# Altium schematic sheet fMUX_MB.SchDoc: FPGA Motherboard for Digital Multiplexed Readout, McGill U.
size Tabloid; DocumentNumber: DfMUX1; Revision: Rev0, Prototype; SheetNumber: 1; SheetTotal: 27; PageSetup: Record=PageOptions|CenterHorizontal=True|CenterVertical=True|PrintScale=0.72|XCorrection=1.00|YCorrection=1.00|PrintKind=0|BorderSize=5000000|LeftOffset=0|BottomOffset=0|Orientation=2|PaperLength=1000|PaperWidth=1000|Scale=100|PaperSource=7|PrintQuality=-4|MediaType=1|DitherType=10|PaperKind=Letter|PrintScaleMode=1
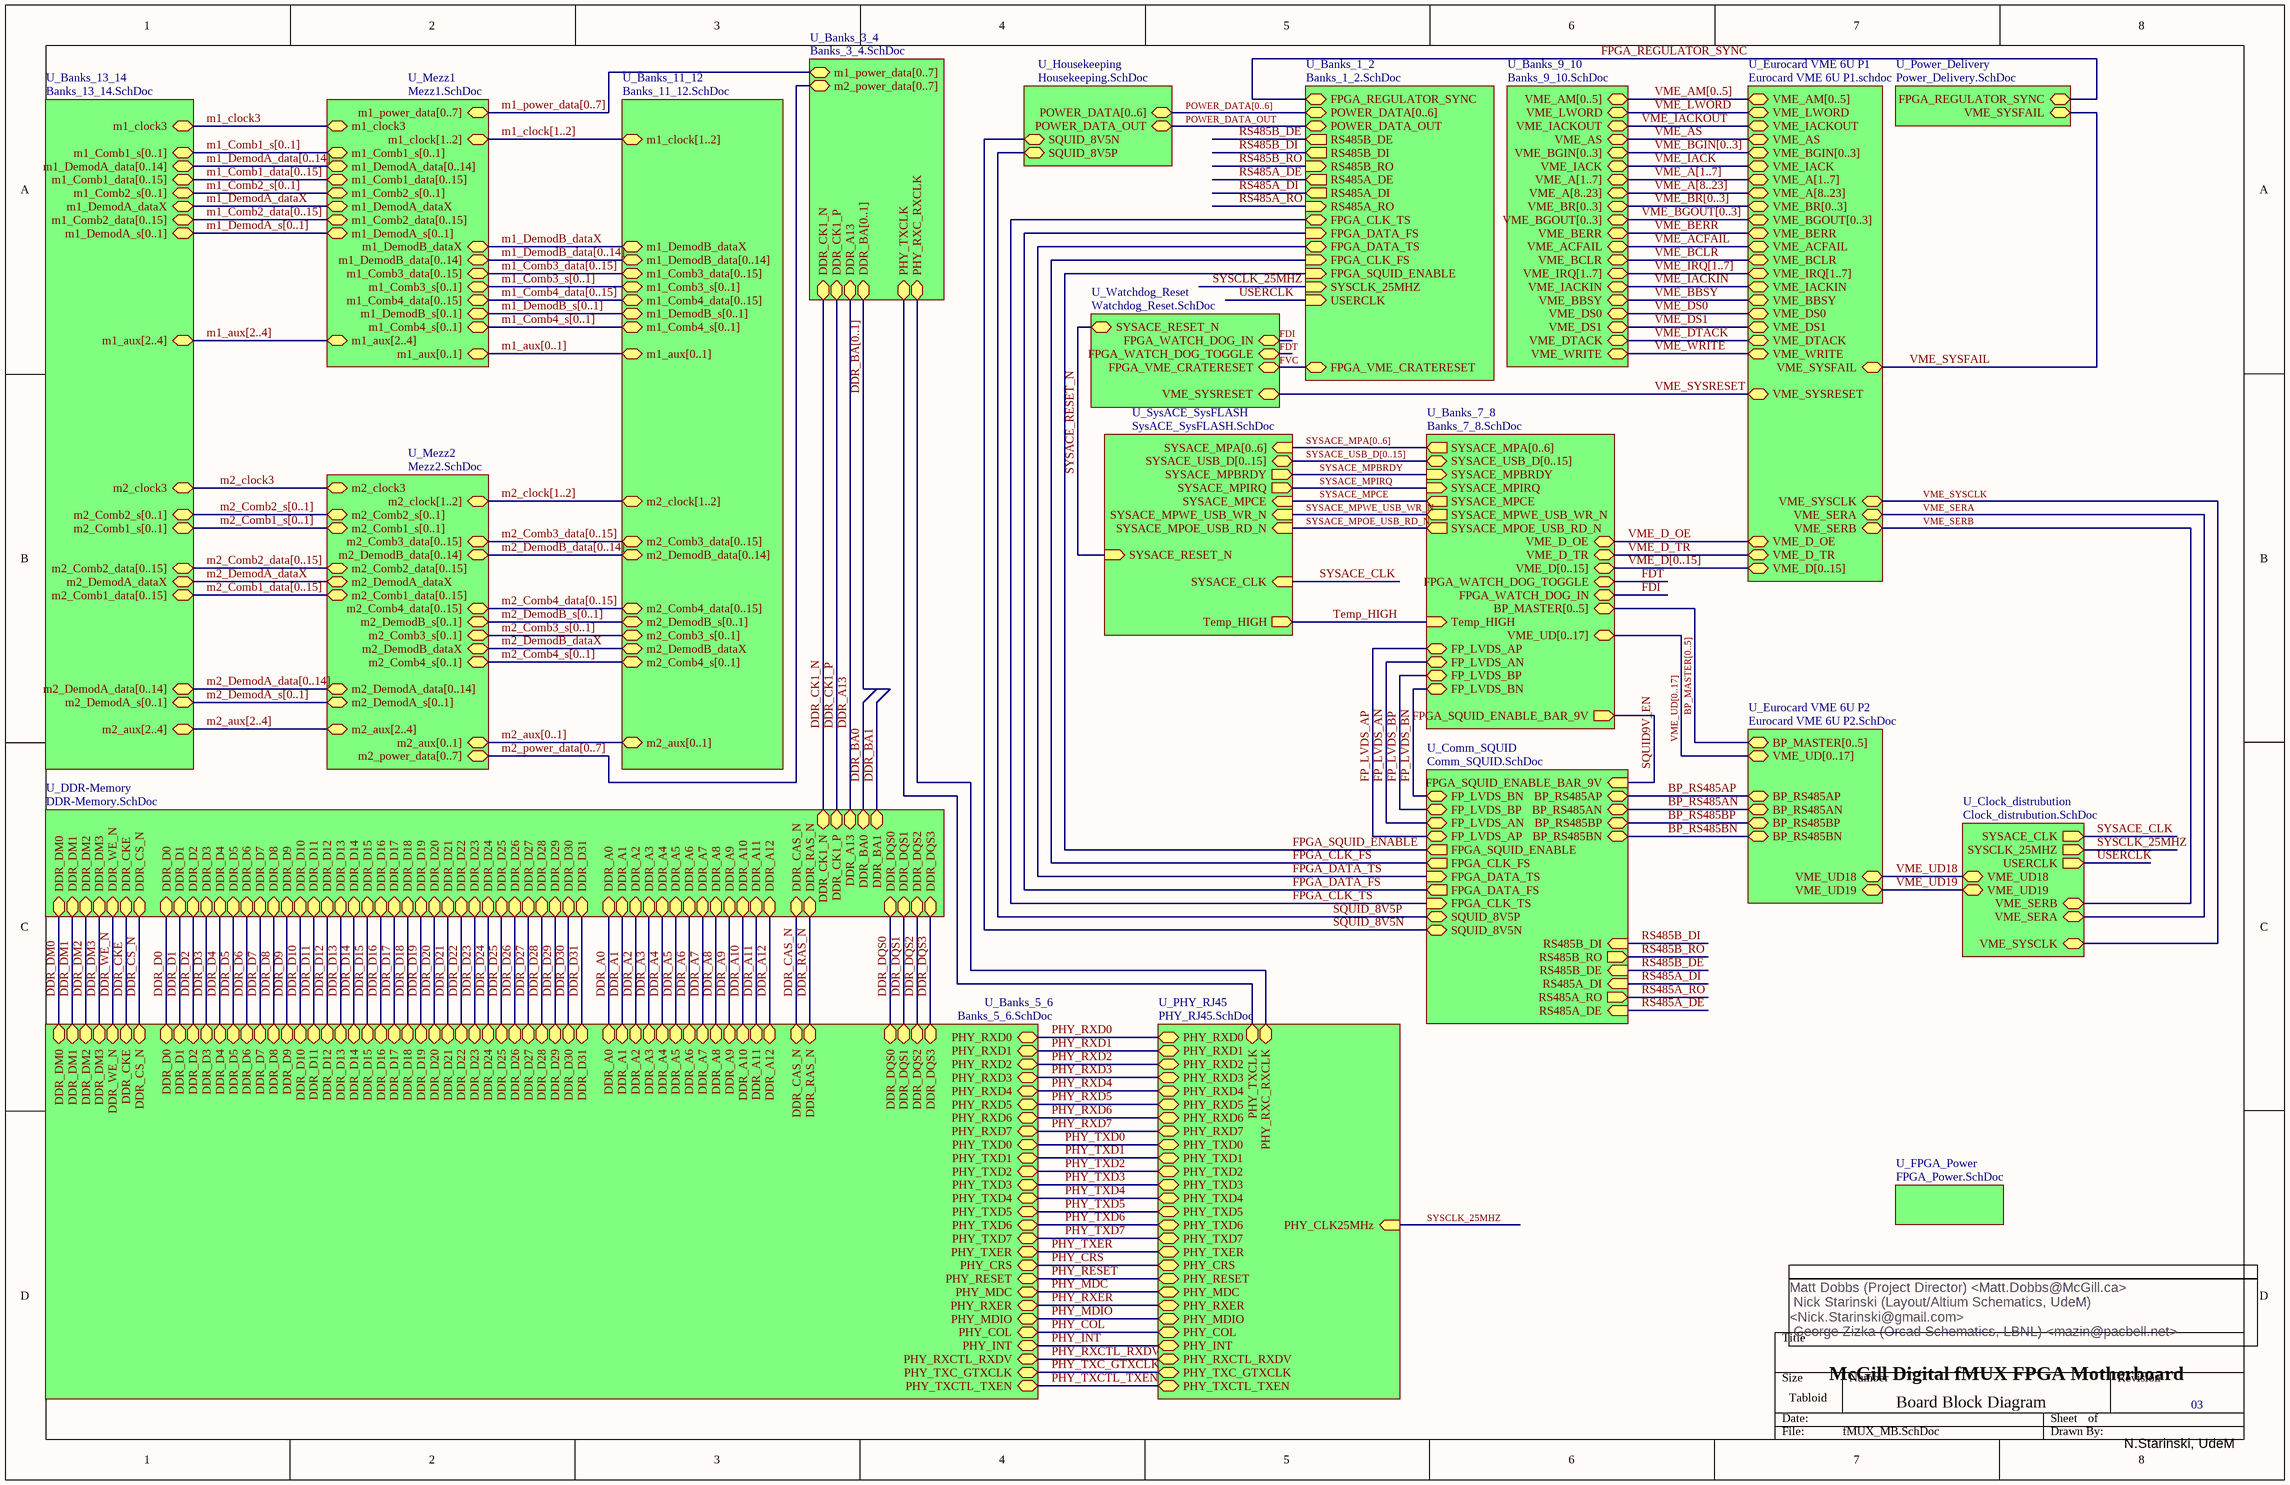
[diagram p0: fMUX_MB.SchDoc]

## Sub-sheets
U_Banks_1_2 = Banks_1_2.SchDoc: POWER_DATA[0..6], POWER_DATA_OUT (bidir), RS485B_RO (in), RS485B_DE (out), FPGA_SQUID_ENABLE (in), SYSCLK_25MHZ (in), USERCLK (in), FPGA_VME_CRATERESET (bidir), RS485A_DE (out), FPGA_REGULATOR_SYNC (bidir), FPGA_DATA_FS (in), FPGA_CLK_TS (bidir), FPGA_DATA_TS (bidir), RS485A_DI (out), FPGA_CLK_FS (in), RS485B_DI (out), RS485A_RO (in)
U_Banks_3_4 = Banks_3_4.SchDoc: m1_power_data[0..7], m2_power_data[0..7] (bidir), DDR_A13 (bidir), DDR_CK1_P (bidir), PHY_TXCLK (bidir), DDR_CK1_N (bidir), PHY_RXC_RXCLK (bidir), DDR_BA[0..1] (bidir)
U_Banks_5_6 = Banks_5_6.SchDoc: DDR_D0 (bidir), DDR_D2 (bidir), DDR_D6 (bidir), DDR_D3 (bidir), DDR_D8 (bidir), DDR_D1 (bidir), DDR_D9 (bidir), DDR_D7 (bidir), DDR_D11 (bidir), DDR_D12 (bidir), DDR_D13 (bidir), DDR_D29 (bidir), DDR_A1 (bidir), DDR_D4 (bidir), DDR_D5 (bidir), DDR_D16 (bidir), DDR_DQS3 (bidir), DDR_DM2 (bidir), DDR_DQS2 (bidir), DDR_D15 (bidir), DDR_D18 (bidir), DDR_D19 (bidir), DDR_D20 (bidir), DDR_A7 (bidir), DDR_A8 (bidir), DDR_A11 (bidir), DDR_D10 (bidir), DDR_D17 (bidir), DDR_A12 (bidir), DDR_DM0 (bidir), DDR_DQS1 (bidir), DDR_A2 (bidir), DDR_CAS_N (bidir), DDR_A9 (bidir), DDR_DM3 (bidir), DDR_DQS0 (bidir), DDR_RAS_N (bidir), DDR_DM1 (bidir), DDR_D14 (bidir), DDR_A4 (bidir), DDR_A5 (bidir), DDR_A10 (bidir), DDR_WE_N (bidir), DDR_D21 (bidir), DDR_D22 (bidir), DDR_D23 (bidir), DDR_D24 (bidir), DDR_A6 (bidir), DDR_A3 (bidir), DDR_D26 (bidir), DDR_D31 (bidir), DDR_A0 (bidir), DDR_D27 (bidir), DDR_D28 (bidir), DDR_D30 (bidir), DDR_D25 (bidir), PHY_TXD6 (bidir), PHY_RXD0 (bidir), PHY_RXD2 (bidir), PHY_RXD7 (bidir), PHY_MDIO (bidir), PHY_TXCTL_TXEN (bidir), PHY_RXD4 (bidir), PHY_RXD5 (bidir), PHY_RXD6 (bidir), PHY_TXER (bidir), PHY_MDC (bidir), PHY_COL (bidir), PHY_RXD3 (bidir), PHY_RXER (bidir), PHY_TXD1 (bidir), PHY_TXD3 (bidir), PHY_RXD1 (bidir), PHY_RXCTL_RXDV (bidir), PHY_CRS (bidir), PHY_TXC_GTXCLK (bidir), PHY_RESET (bidir), PHY_TXD0 (bidir), PHY_TXD5 (bidir), PHY_TXD2 (bidir), PHY_TXD4 (bidir), PHY_TXD7 (bidir), PHY_INT (bidir), DDR_CS_N (bidir), DDR_CKE (bidir)
U_Banks_7_8 = Banks_7_8.SchDoc: BP_MASTER[0..5], FP_LVDS_BP (bidir), VME_D[0..15] (bidir), FP_LVDS_BN (bidir), FP_LVDS_AP (bidir), FP_LVDS_AN (bidir), VME_UD[0..17] (bidir), SYSACE_MPA[0..6] (out), SYSACE_USB_D[0..15], VME_D_OE (bidir), SYSACE_MPIRQ (in), SYSACE_MPCE (out), VME_D_TR (bidir), SYSACE_MPBRDY (in), SYSACE_MPOE_USB_RD_N (out), SYSACE_MPWE_USB_WR_N (out), Temp_HIGH (in), FPGA_WATCH_DOG_TOGGLE (bidir), FPGA_WATCH_DOG_IN (bidir), FPGA_SQUID_ENABLE_BAR_9V (out)
U_Banks_9_10 = Banks_9_10.SchDoc: VME_AM[0..5] (bidir), VME_LWORD (bidir), VME_IACKOUT (bidir), VME_AS (bidir), VME_BGIN[0..3] (bidir), VME_IACK (bidir), VME_A[8..23] (bidir), VME_BR[0..3] (bidir), VME_BGOUT[0..3] (bidir), VME_BERR (bidir), VME_A[1..7] (bidir), VME_ACFAIL (bidir), VME_BCLR (bidir), VME_IRQ[1..7] (bidir), VME_IACKIN (bidir), VME_BBSY (bidir), VME_DS0 (bidir), VME_DS1 (bidir), VME_DTACK (bidir), VME_WRITE (bidir)
U_Banks_11_12 = Banks_11_12.SchDoc: m1_Comb3_s[0..1] (bidir), m2_Comb3_s[0..1] (bidir), m1_Comb4_s[0..1] (bidir), m2_Comb4_s[0..1] (bidir), m2_DemodB_data[0..14] (bidir), m1_DemodB_data[0..14] (bidir), m1_Comb4_data[0..15] (bidir), m1_Comb3_data[0..15] (bidir), m2_Comb3_data[0..15] (bidir), m2_Comb4_data[0..15] (bidir), m2_aux[0..1] (bidir), m1_DemodB_s[0..1] (bidir), m2_DemodB_s[0..1] (bidir), m1_clock[1..2] (bidir), m1_DemodB_dataX (bidir), m2_DemodB_dataX (bidir), m2_clock[1..2] (bidir), m1_aux[0..1] (bidir)
U_Banks_13_14 = Banks_13_14.SchDoc: m2_DemodA_s[0..1] (bidir), m1_clock3 (bidir), m1_DemodA_data[0..14] (bidir), m2_Comb1_data[0..15] (bidir), m1_DemodA_s[0..1] (bidir), m1_Comb2_data[0..15] (bidir), m2_Comb1_s[0..1] (bidir), m1_aux[2..4] (bidir), m2_Comb2_data[0..15] (bidir), m2_Comb2_s[0..1] (bidir), m2_aux[2..4] (bidir), m1_Comb1_data[0..15] (bidir), m1_Comb2_s[0..1] (bidir), m1_Comb1_s[0..1] (bidir), m1_DemodA_dataX (bidir), m2_DemodA_dataX (bidir), m2_DemodA_data[0..14] (bidir), m2_clock3 (bidir)
U_Clock_distrubution = Clock_distrubution.SchDoc: SYSACE_CLK (out), SYSCLK_25MHZ (out), USERCLK (out), VME_UD18 (bidir), VME_UD19 (bidir), VME_SYSCLK (bidir), VME_SERA (bidir), VME_SERB (bidir)
U_Comm_SQUID = Comm_SQUID.SchDoc: BP_RS485BP (bidir), BP_RS485BN (bidir), BP_RS485AP (bidir), BP_RS485AN (bidir), FP_LVDS_BN (bidir), FP_LVDS_BP (bidir), FP_LVDS_AN (bidir), FP_LVDS_AP (bidir), FPGA_CLK_TS (in), FPGA_DATA_FS (out), FPGA_CLK_FS (out), SQUID_8V5N, FPGA_DATA_TS (in), RS485B_DE (in), RS485B_RO (out), RS485A_DE (in), RS485A_RO (out), SQUID_8V5P, RS485A_DI (in), FPGA_SQUID_ENABLE (out), RS485B_DI (in), FPGA_SQUID_ENABLE_BAR_9V (in)
U_DDR-Memory = DDR-Memory.SchDoc: DDR_A11 (bidir), DDR_D27 (bidir), DDR_D7 (bidir), DDR_A8 (bidir), DDR_D25 (bidir), DDR_A7 (bidir), DDR_A6 (bidir), DDR_DM0 (bidir), DDR_DM1 (bidir), DDR_D20 (bidir), DDR_DQS2 (bidir), DDR_DQS3 (bidir), DDR_D16 (bidir), DDR_D8 (bidir), DDR_D13 (bidir), DDR_D0 (bidir), DDR_A4 (bidir), DDR_D19 (bidir), DDR_A2 (bidir), DDR_A12 (bidir), DDR_D28 (bidir), DDR_D30 (bidir), DDR_A13 (bidir), DDR_A5 (bidir), DDR_D10 (bidir), DDR_A10 (bidir), DDR_D12 (bidir), DDR_D31 (bidir), DDR_DM3 (bidir), DDR_D14 (bidir), DDR_D29 (bidir), DDR_D21 (bidir), DDR_D24 (bidir), DDR_D6 (bidir), DDR_D11 (bidir), DDR_D5 (bidir), DDR_D15 (bidir), DDR_D4 (bidir), DDR_D18 (bidir), DDR_D2 (bidir), DDR_D9 (bidir), DDR_A3 (bidir), DDR_A0 (bidir), DDR_CK1_N (bidir), DDR_D3 (bidir), DDR_D23 (bidir), DDR_D26 (bidir), DDR_D17 (bidir), DDR_A1 (bidir), DDR_DM2 (bidir), DDR_A9 (bidir), DDR_D1 (bidir), DDR_BA0 (bidir), DDR_DQS1 (bidir), DDR_CAS_N (bidir), DDR_CS_N (bidir), DDR_CKE (bidir), DDR_WE_N (bidir), DDR_BA1 (bidir), DDR_D22 (bidir), DDR_DQS0 (bidir), DDR_CK1_P (bidir), DDR_RAS_N (bidir)
U_Eurocard VME 6U P1 = Eurocard VME 6U P1.schdoc: VME_DTACK (bidir), VME_BGIN[0..3] (bidir), VME_BCLR (bidir), VME_IACKIN (bidir), VME_BGOUT[0..3] (bidir), VME_IRQ[1..7] (bidir), VME_BBSY (bidir), VME_BR[0..3] (bidir), VME_DS1 (bidir), VME_ACFAIL (bidir), VME_A[1..7] (bidir), VME_IACK (bidir), VME_AM[0..5] (bidir), VME_D[0..15] (bidir), VME_BERR (bidir), VME_LWORD (bidir), VME_IACKOUT (bidir), VME_A[8..23] (bidir), VME_WRITE (bidir), VME_AS (bidir), VME_DS0 (bidir), VME_SYSFAIL (bidir), VME_D_OE (bidir), VME_SYSRESET (bidir), VME_D_TR (bidir), VME_SYSCLK (bidir), VME_SERA (bidir), VME_SERB (bidir)
U_Eurocard VME 6U P2 = Eurocard VME 6U P2.SchDoc: BP_RS485BN (bidir), BP_MASTER[0..5], BP_RS485BP (bidir), BP_RS485AN (bidir), BP_RS485AP (bidir), VME_UD[0..17] (bidir), VME_UD18 (bidir), VME_UD19 (bidir)
U_FPGA_Power = FPGA_Power.SchDoc: no entries
U_Housekeeping = Housekeeping.SchDoc: POWER_DATA[0..6], POWER_DATA_OUT (bidir), SQUID_8V5N, SQUID_8V5P
U_Mezz1 = Mezz1.SchDoc: m1_power_data[0..7], m1_Comb1_s[0..1] (bidir), m1_DemodA_data[0..14] (bidir), m1_Comb1_data[0..15] (bidir), m1_DemodB_data[0..14] (bidir), m1_DemodB_dataX (bidir), m1_Comb4_s[0..1] (bidir), m1_Comb2_data[0..15] (bidir), m1_DemodB_s[0..1] (bidir), m1_DemodA_s[0..1] (bidir), m1_DemodA_dataX (bidir), m1_Comb3_data[0..15] (bidir), m1_Comb2_s[0..1] (bidir), m1_Comb3_s[0..1] (bidir), m1_Comb4_data[0..15] (bidir), m1_aux[2..4] (bidir), m1_clock[1..2] (bidir), m1_clock3 (bidir), m1_aux[0..1] (bidir)
U_Mezz2 = Mezz2.SchDoc: m2_power_data[0..7] (bidir), m2_Comb3_s[0..1] (bidir), m2_Comb2_data[0..15] (bidir), m2_DemodA_s[0..1] (bidir), m2_Comb4_s[0..1] (bidir), m2_Comb4_data[0..15] (bidir), m2_DemodB_s[0..1] (bidir), m2_DemodA_data[0..14] (bidir), m2_Comb2_s[0..1] (bidir), m2_Comb3_data[0..15] (bidir), m2_DemodB_data[0..14] (bidir), m2_Comb1_data[0..15] (bidir), m2_Comb1_s[0..1] (bidir), m2_DemodA_dataX (bidir), m2_DemodB_dataX (bidir), m2_clock[1..2] (bidir), m2_aux[2..4] (bidir), m2_clock3 (bidir), m2_aux[0..1] (bidir)
U_PHY_RJ45 = PHY_RJ45.SchDoc: PHY_RXD3 (bidir), PHY_RXD4 (bidir), PHY_RXD0 (bidir), PHY_RXD5 (bidir), PHY_RXD1 (bidir), PHY_RXD7 (bidir), PHY_RXD6 (bidir), PHY_RXD2 (bidir), PHY_RXC_RXCLK (bidir), PHY_TXCLK (bidir), PHY_TXD3 (bidir), PHY_TXD5 (bidir), PHY_MDC (bidir), PHY_TXER (bidir), PHY_CRS (bidir), PHY_TXC_GTXCLK (bidir), PHY_RXCTL_RXDV (bidir), PHY_TXCTL_TXEN (bidir), PHY_COL (bidir), PHY_TXD4 (bidir), PHY_TXD7 (bidir), PHY_RESET (bidir), PHY_INT (bidir), PHY_TXD2 (bidir), PHY_TXD1 (bidir), PHY_TXD6 (bidir), PHY_RXER (bidir), PHY_MDIO (bidir), PHY_TXD0 (bidir), PHY_CLK25MHz (in)
U_Power_Delivery = Power_Delivery.SchDoc: FPGA_REGULATOR_SYNC (bidir), VME_SYSFAIL (bidir)
U_SysACE_SysFLASH = SysACE_SysFLASH.SchDoc: SYSACE_MPCE (in), SYSACE_USB_D[0..15], SYSACE_MPIRQ (out), SYSACE_MPA[0..6] (in), SYSACE_MPBRDY (out), SYSACE_MPWE_USB_WR_N (in), SYSACE_MPOE_USB_RD_N (in), SYSACE_RESET_N (in), SYSACE_CLK (in), Temp_HIGH (out)
U_Watchdog_Reset = Watchdog_Reset.SchDoc: SYSACE_RESET_N (bidir), FPGA_WATCH_DOG_TOGGLE (bidir), VME_SYSRESET (bidir), FPGA_VME_CRATERESET (bidir), FPGA_WATCH_DOG_IN (bidir)

## Nets
BP_RS485AN: sheet U_Eurocard VME 6U P2/BP_RS485AN, sheet U_Comm_SQUID/BP_RS485AN
BP_RS485AP: sheet U_Eurocard VME 6U P2/BP_RS485AP, sheet U_Comm_SQUID/BP_RS485AP
BP_RS485BN: sheet U_Eurocard VME 6U P2/BP_RS485BN, sheet U_Comm_SQUID/BP_RS485BN
BP_RS485BP: sheet U_Eurocard VME 6U P2/BP_RS485BP, sheet U_Comm_SQUID/BP_RS485BP
DDR_A0: sheet U_Banks_5_6/DDR_A0, sheet U_DDR-Memory/DDR_A0
DDR_A1: sheet U_Banks_5_6/DDR_A1, sheet U_DDR-Memory/DDR_A1
DDR_A2: sheet U_Banks_5_6/DDR_A2, sheet U_DDR-Memory/DDR_A2
DDR_A3: sheet U_Banks_5_6/DDR_A3, sheet U_DDR-Memory/DDR_A3
DDR_A4: sheet U_Banks_5_6/DDR_A4, sheet U_DDR-Memory/DDR_A4
DDR_A5: sheet U_Banks_5_6/DDR_A5, sheet U_DDR-Memory/DDR_A5
DDR_A6: sheet U_Banks_5_6/DDR_A6, sheet U_DDR-Memory/DDR_A6
DDR_A7: sheet U_Banks_5_6/DDR_A7, sheet U_DDR-Memory/DDR_A7
DDR_A8: sheet U_Banks_5_6/DDR_A8, sheet U_DDR-Memory/DDR_A8
DDR_A9: sheet U_Banks_5_6/DDR_A9, sheet U_DDR-Memory/DDR_A9
DDR_A10: sheet U_Banks_5_6/DDR_A10, sheet U_DDR-Memory/DDR_A10
DDR_A11: sheet U_Banks_5_6/DDR_A11, sheet U_DDR-Memory/DDR_A11
DDR_A12: sheet U_Banks_5_6/DDR_A12, sheet U_DDR-Memory/DDR_A12
DDR_A13: sheet U_Banks_3_4/DDR_A13, sheet U_DDR-Memory/DDR_A13
DDR_BA0: sheet U_DDR-Memory/DDR_BA0
DDR_BA1: sheet U_DDR-Memory/DDR_BA1
DDR_CAS_N: sheet U_Banks_5_6/DDR_CAS_N, sheet U_DDR-Memory/DDR_CAS_N
DDR_CK1_N: sheet U_Banks_3_4/DDR_CK1_N, sheet U_DDR-Memory/DDR_CK1_N
DDR_CK1_P: sheet U_Banks_3_4/DDR_CK1_P, sheet U_DDR-Memory/DDR_CK1_P
DDR_CKE: sheet U_Banks_5_6/DDR_CKE, sheet U_DDR-Memory/DDR_CKE
DDR_CS_N: sheet U_Banks_5_6/DDR_CS_N, sheet U_DDR-Memory/DDR_CS_N
DDR_D0: sheet U_Banks_5_6/DDR_D0, sheet U_DDR-Memory/DDR_D0
DDR_D1: sheet U_Banks_5_6/DDR_D1, sheet U_DDR-Memory/DDR_D1
DDR_D2: sheet U_Banks_5_6/DDR_D2, sheet U_DDR-Memory/DDR_D2
DDR_D3: sheet U_Banks_5_6/DDR_D3, sheet U_DDR-Memory/DDR_D3
DDR_D4: sheet U_Banks_5_6/DDR_D4, sheet U_DDR-Memory/DDR_D4
DDR_D5: sheet U_Banks_5_6/DDR_D5, sheet U_DDR-Memory/DDR_D5
DDR_D6: sheet U_Banks_5_6/DDR_D6, sheet U_DDR-Memory/DDR_D6
DDR_D7: sheet U_Banks_5_6/DDR_D7, sheet U_DDR-Memory/DDR_D7
DDR_D8: sheet U_Banks_5_6/DDR_D8, sheet U_DDR-Memory/DDR_D8
DDR_D9: sheet U_Banks_5_6/DDR_D9, sheet U_DDR-Memory/DDR_D9
DDR_D10: sheet U_Banks_5_6/DDR_D10, sheet U_DDR-Memory/DDR_D10
DDR_D11: sheet U_Banks_5_6/DDR_D11, sheet U_DDR-Memory/DDR_D11
DDR_D12: sheet U_Banks_5_6/DDR_D12, sheet U_DDR-Memory/DDR_D12
DDR_D13: sheet U_Banks_5_6/DDR_D13, sheet U_DDR-Memory/DDR_D13
DDR_D14: sheet U_Banks_5_6/DDR_D14, sheet U_DDR-Memory/DDR_D14
DDR_D15: sheet U_Banks_5_6/DDR_D15, sheet U_DDR-Memory/DDR_D15
DDR_D16: sheet U_Banks_5_6/DDR_D16, sheet U_DDR-Memory/DDR_D16
DDR_D17: sheet U_Banks_5_6/DDR_D17, sheet U_DDR-Memory/DDR_D17
DDR_D18: sheet U_Banks_5_6/DDR_D18, sheet U_DDR-Memory/DDR_D18
DDR_D19: sheet U_Banks_5_6/DDR_D19, sheet U_DDR-Memory/DDR_D19
DDR_D20: sheet U_Banks_5_6/DDR_D20, sheet U_DDR-Memory/DDR_D20
DDR_D21: sheet U_Banks_5_6/DDR_D21, sheet U_DDR-Memory/DDR_D21
DDR_D22: sheet U_Banks_5_6/DDR_D22, sheet U_DDR-Memory/DDR_D22
DDR_D23: sheet U_Banks_5_6/DDR_D23, sheet U_DDR-Memory/DDR_D23
DDR_D24: sheet U_Banks_5_6/DDR_D24, sheet U_DDR-Memory/DDR_D24
DDR_D25: sheet U_Banks_5_6/DDR_D25, sheet U_DDR-Memory/DDR_D25
DDR_D26: sheet U_Banks_5_6/DDR_D26, sheet U_DDR-Memory/DDR_D26
DDR_D27: sheet U_Banks_5_6/DDR_D27, sheet U_DDR-Memory/DDR_D27
DDR_D28: sheet U_Banks_5_6/DDR_D28, sheet U_DDR-Memory/DDR_D28
DDR_D29: sheet U_Banks_5_6/DDR_D29, sheet U_DDR-Memory/DDR_D29
DDR_D30: sheet U_Banks_5_6/DDR_D30, sheet U_DDR-Memory/DDR_D30
DDR_D31: sheet U_Banks_5_6/DDR_D31, sheet U_DDR-Memory/DDR_D31
DDR_DM0: sheet U_Banks_5_6/DDR_DM0, sheet U_DDR-Memory/DDR_DM0
DDR_DM1: sheet U_Banks_5_6/DDR_DM1, sheet U_DDR-Memory/DDR_DM1
DDR_DM2: sheet U_Banks_5_6/DDR_DM2, sheet U_DDR-Memory/DDR_DM2
DDR_DM3: sheet U_Banks_5_6/DDR_DM3, sheet U_DDR-Memory/DDR_DM3
DDR_DQS0: sheet U_Banks_5_6/DDR_DQS0, sheet U_DDR-Memory/DDR_DQS0
DDR_DQS1: sheet U_Banks_5_6/DDR_DQS1, sheet U_DDR-Memory/DDR_DQS1
DDR_DQS2: sheet U_Banks_5_6/DDR_DQS2, sheet U_DDR-Memory/DDR_DQS2
DDR_DQS3: sheet U_Banks_5_6/DDR_DQS3, sheet U_DDR-Memory/DDR_DQS3
DDR_RAS_N: sheet U_Banks_5_6/DDR_RAS_N, sheet U_DDR-Memory/DDR_RAS_N
DDR_WE_N: sheet U_Banks_5_6/DDR_WE_N, sheet U_DDR-Memory/DDR_WE_N
FDI: sheet U_Banks_7_8/FPGA_WATCH_DOG_IN, sheet U_Watchdog_Reset/FPGA_WATCH_DOG_IN
FDT: sheet U_Banks_7_8/FPGA_WATCH_DOG_TOGGLE, sheet U_Watchdog_Reset/FPGA_WATCH_DOG_TOGGLE
FP_LVDS_AN: sheet U_Banks_7_8/FP_LVDS_AN, sheet U_Comm_SQUID/FP_LVDS_AN
FP_LVDS_AP: sheet U_Banks_7_8/FP_LVDS_AP, sheet U_Comm_SQUID/FP_LVDS_AP
FP_LVDS_BN: sheet U_Banks_7_8/FP_LVDS_BN, sheet U_Comm_SQUID/FP_LVDS_BN
FP_LVDS_BP: sheet U_Banks_7_8/FP_LVDS_BP, sheet U_Comm_SQUID/FP_LVDS_BP
FPGA_CLK_FS: sheet U_Banks_1_2/FPGA_CLK_FS, sheet U_Comm_SQUID/FPGA_CLK_FS
FPGA_CLK_TS: sheet U_Banks_1_2/FPGA_CLK_TS, sheet U_Comm_SQUID/FPGA_CLK_TS
FPGA_DATA_FS: sheet U_Banks_1_2/FPGA_DATA_FS, sheet U_Comm_SQUID/FPGA_DATA_FS
FPGA_DATA_TS: sheet U_Banks_1_2/FPGA_DATA_TS, sheet U_Comm_SQUID/FPGA_DATA_TS
FPGA_REGULATOR_SYNC: sheet U_Banks_1_2/FPGA_REGULATOR_SYNC, sheet U_Power_Delivery/FPGA_REGULATOR_SYNC
FPGA_SQUID_ENABLE: sheet U_Banks_1_2/FPGA_SQUID_ENABLE, sheet U_Comm_SQUID/FPGA_SQUID_ENABLE
FVC: sheet U_Banks_1_2/FPGA_VME_CRATERESET, sheet U_Watchdog_Reset/FPGA_VME_CRATERESET
m1_clock3: sheet U_Banks_13_14/m1_clock3, sheet U_Mezz1/m1_clock3
m1_DemodA_dataX: sheet U_Banks_13_14/m1_DemodA_dataX, sheet U_Mezz1/m1_DemodA_dataX
m1_DemodB_dataX: sheet U_Banks_11_12/m1_DemodB_dataX, sheet U_Mezz1/m1_DemodB_dataX
m2_clock3: sheet U_Banks_13_14/m2_clock3, sheet U_Mezz2/m2_clock3
m2_DemodA_dataX: sheet U_Banks_13_14/m2_DemodA_dataX, sheet U_Mezz2/m2_DemodA_dataX
m2_DemodB_dataX: sheet U_Banks_11_12/m2_DemodB_dataX, sheet U_Mezz2/m2_DemodB_dataX
PHY_COL: sheet U_Banks_5_6/PHY_COL, sheet U_PHY_RJ45/PHY_COL
PHY_CRS: sheet U_Banks_5_6/PHY_CRS, sheet U_PHY_RJ45/PHY_CRS
PHY_INT: sheet U_Banks_5_6/PHY_INT, sheet U_PHY_RJ45/PHY_INT
PHY_MDC: sheet U_Banks_5_6/PHY_MDC, sheet U_PHY_RJ45/PHY_MDC
PHY_MDIO: sheet U_Banks_5_6/PHY_MDIO, sheet U_PHY_RJ45/PHY_MDIO
PHY_RESET: sheet U_Banks_5_6/PHY_RESET, sheet U_PHY_RJ45/PHY_RESET
PHY_RXCTL_RXDV: sheet U_Banks_5_6/PHY_RXCTL_RXDV, sheet U_PHY_RJ45/PHY_RXCTL_RXDV
PHY_RXD0: sheet U_Banks_5_6/PHY_RXD0, sheet U_PHY_RJ45/PHY_RXD0
PHY_RXD1: sheet U_Banks_5_6/PHY_RXD1, sheet U_PHY_RJ45/PHY_RXD1
PHY_RXD2: sheet U_Banks_5_6/PHY_RXD2, sheet U_PHY_RJ45/PHY_RXD2
PHY_RXD3: sheet U_Banks_5_6/PHY_RXD3, sheet U_PHY_RJ45/PHY_RXD3
PHY_RXD4: sheet U_Banks_5_6/PHY_RXD4, sheet U_PHY_RJ45/PHY_RXD4
PHY_RXD5: sheet U_Banks_5_6/PHY_RXD5, sheet U_PHY_RJ45/PHY_RXD5
PHY_RXD6: sheet U_Banks_5_6/PHY_RXD6, sheet U_PHY_RJ45/PHY_RXD6
PHY_RXD7: sheet U_Banks_5_6/PHY_RXD7, sheet U_PHY_RJ45/PHY_RXD7
PHY_RXER: sheet U_Banks_5_6/PHY_RXER, sheet U_PHY_RJ45/PHY_RXER
PHY_TXC_GTXCLK: sheet U_Banks_5_6/PHY_TXC_GTXCLK, sheet U_PHY_RJ45/PHY_TXC_GTXCLK
PHY_TXCTL_TXEN: sheet U_Banks_5_6/PHY_TXCTL_TXEN, sheet U_PHY_RJ45/PHY_TXCTL_TXEN
PHY_TXD0: sheet U_Banks_5_6/PHY_TXD0, sheet U_PHY_RJ45/PHY_TXD0
PHY_TXD1: sheet U_Banks_5_6/PHY_TXD1, sheet U_PHY_RJ45/PHY_TXD1
PHY_TXD2: sheet U_Banks_5_6/PHY_TXD2, sheet U_PHY_RJ45/PHY_TXD2
PHY_TXD3: sheet U_Banks_5_6/PHY_TXD3, sheet U_PHY_RJ45/PHY_TXD3
PHY_TXD4: sheet U_Banks_5_6/PHY_TXD4, sheet U_PHY_RJ45/PHY_TXD4
PHY_TXD5: sheet U_Banks_5_6/PHY_TXD5, sheet U_PHY_RJ45/PHY_TXD5
PHY_TXD6: sheet U_Banks_5_6/PHY_TXD6, sheet U_PHY_RJ45/PHY_TXD6
PHY_TXD7: sheet U_Banks_5_6/PHY_TXD7, sheet U_PHY_RJ45/PHY_TXD7
PHY_TXER: sheet U_Banks_5_6/PHY_TXER, sheet U_PHY_RJ45/PHY_TXER
POWER_DATA_OUT: sheet U_Banks_1_2/POWER_DATA_OUT, sheet U_Housekeeping/POWER_DATA_OUT
RS485A_DE: sheet U_Banks_1_2/RS485A_DE, sheet U_Comm_SQUID/RS485A_DE
RS485A_DI: sheet U_Banks_1_2/RS485A_DI, sheet U_Comm_SQUID/RS485A_DI
RS485A_RO: sheet U_Banks_1_2/RS485A_RO, sheet U_Comm_SQUID/RS485A_RO
RS485B_DE: sheet U_Banks_1_2/RS485B_DE, sheet U_Comm_SQUID/RS485B_DE
RS485B_DI: sheet U_Banks_1_2/RS485B_DI, sheet U_Comm_SQUID/RS485B_DI
RS485B_RO: sheet U_Banks_1_2/RS485B_RO, sheet U_Comm_SQUID/RS485B_RO
SQUID9V_EN: sheet U_Banks_7_8/FPGA_SQUID_ENABLE_BAR_9V, sheet U_Comm_SQUID/FPGA_SQUID_ENABLE_BAR_9V
SQUID_8V5N: sheet U_Housekeeping/SQUID_8V5N, sheet U_Comm_SQUID/SQUID_8V5N
SQUID_8V5P: sheet U_Housekeeping/SQUID_8V5P, sheet U_Comm_SQUID/SQUID_8V5P
SYSACE_CLK: sheet U_Clock_distrubution/SYSACE_CLK, sheet U_SysACE_SysFLASH/SYSACE_CLK
SYSACE_MPBRDY: sheet U_Banks_7_8/SYSACE_MPBRDY, sheet U_SysACE_SysFLASH/SYSACE_MPBRDY
SYSACE_MPCE: sheet U_Banks_7_8/SYSACE_MPCE, sheet U_SysACE_SysFLASH/SYSACE_MPCE
SYSACE_MPIRQ: sheet U_Banks_7_8/SYSACE_MPIRQ, sheet U_SysACE_SysFLASH/SYSACE_MPIRQ
SYSACE_MPOE_USB_RD_N: sheet U_Banks_7_8/SYSACE_MPOE_USB_RD_N, sheet U_SysACE_SysFLASH/SYSACE_MPOE_USB_RD_N
SYSACE_MPWE_USB_WR_N: sheet U_Banks_7_8/SYSACE_MPWE_USB_WR_N, sheet U_SysACE_SysFLASH/SYSACE_MPWE_USB_WR_N
SYSACE_RESET_N: sheet U_SysACE_SysFLASH/SYSACE_RESET_N, sheet U_Watchdog_Reset/SYSACE_RESET_N
SYSCLK_25MHZ: sheet U_Banks_1_2/SYSCLK_25MHZ, sheet U_Clock_distrubution/SYSCLK_25MHZ, sheet U_PHY_RJ45/PHY_CLK25MHz
Temp_HIGH: sheet U_Banks_7_8/Temp_HIGH, sheet U_SysACE_SysFLASH/Temp_HIGH
USERCLK: sheet U_Banks_1_2/USERCLK, sheet U_Clock_distrubution/USERCLK
VME_ACFAIL: sheet U_Banks_9_10/VME_ACFAIL, sheet U_Eurocard VME 6U P1/VME_ACFAIL
VME_AS: sheet U_Banks_9_10/VME_AS, sheet U_Eurocard VME 6U P1/VME_AS
VME_BBSY: sheet U_Banks_9_10/VME_BBSY, sheet U_Eurocard VME 6U P1/VME_BBSY
VME_BCLR: sheet U_Banks_9_10/VME_BCLR, sheet U_Eurocard VME 6U P1/VME_BCLR
VME_BERR: sheet U_Banks_9_10/VME_BERR, sheet U_Eurocard VME 6U P1/VME_BERR
VME_D_OE: sheet U_Banks_7_8/VME_D_OE, sheet U_Eurocard VME 6U P1/VME_D_OE
VME_D_TR: sheet U_Banks_7_8/VME_D_TR, sheet U_Eurocard VME 6U P1/VME_D_TR
VME_DS0: sheet U_Banks_9_10/VME_DS0, sheet U_Eurocard VME 6U P1/VME_DS0
VME_DS1: sheet U_Banks_9_10/VME_DS1, sheet U_Eurocard VME 6U P1/VME_DS1
VME_DTACK: sheet U_Banks_9_10/VME_DTACK, sheet U_Eurocard VME 6U P1/VME_DTACK
VME_IACK: sheet U_Banks_9_10/VME_IACK, sheet U_Eurocard VME 6U P1/VME_IACK
VME_IACKIN: sheet U_Banks_9_10/VME_IACKIN, sheet U_Eurocard VME 6U P1/VME_IACKIN
VME_IACKOUT: sheet U_Banks_9_10/VME_IACKOUT, sheet U_Eurocard VME 6U P1/VME_IACKOUT
VME_LWORD: sheet U_Banks_9_10/VME_LWORD, sheet U_Eurocard VME 6U P1/VME_LWORD
VME_SERA: sheet U_Clock_distrubution/VME_SERA, sheet U_Eurocard VME 6U P1/VME_SERA
VME_SERB: sheet U_Clock_distrubution/VME_SERB, sheet U_Eurocard VME 6U P1/VME_SERB
VME_SYSCLK: sheet U_Clock_distrubution/VME_SYSCLK, sheet U_Eurocard VME 6U P1/VME_SYSCLK
VME_SYSFAIL: sheet U_Power_Delivery/VME_SYSFAIL, sheet U_Eurocard VME 6U P1/VME_SYSFAIL
VME_SYSRESET: sheet U_Eurocard VME 6U P1/VME_SYSRESET, sheet U_Watchdog_Reset/VME_SYSRESET
VME_UD18: sheet U_Clock_distrubution/VME_UD18, sheet U_Eurocard VME 6U P2/VME_UD18
VME_UD19: sheet U_Clock_distrubution/VME_UD19, sheet U_Eurocard VME 6U P2/VME_UD19
VME_WRITE: sheet U_Banks_9_10/VME_WRITE, sheet U_Eurocard VME 6U P1/VME_WRITE
(unnamed): sheet U_Banks_3_4/PHY_TXCLK, sheet U_PHY_RJ45/PHY_TXCLK
(unnamed): sheet U_Banks_3_4/PHY_RXC_RXCLK, sheet U_PHY_RJ45/PHY_RXC_RXCLK

## Buses and harness runs
bus BP_MASTER[0..5] = sheet U_Banks_7_8/BP_MASTER[0..5] = sheet U_Eurocard VME 6U P2/BP_MASTER[0..5]
bus DDR_BA[0..1] = sheet U_Banks_3_4/DDR_BA[0..1]
bus m1_aux[0..1] = sheet U_Banks_11_12/m1_aux[0..1] = sheet U_Mezz1/m1_aux[0..1]
bus m1_aux[2..4] = sheet U_Banks_13_14/m1_aux[2..4] = sheet U_Mezz1/m1_aux[2..4]
bus m1_clock[1..2] = sheet U_Banks_11_12/m1_clock[1..2] = sheet U_Mezz1/m1_clock[1..2]
bus m1_Comb1_data[0..15] = sheet U_Banks_13_14/m1_Comb1_data[0..15] = sheet U_Mezz1/m1_Comb1_data[0..15]
bus m1_Comb1_s[0..1] = sheet U_Banks_13_14/m1_Comb1_s[0..1] = sheet U_Mezz1/m1_Comb1_s[0..1]
bus m1_Comb2_data[0..15] = sheet U_Banks_13_14/m1_Comb2_data[0..15] = sheet U_Mezz1/m1_Comb2_data[0..15]
bus m1_Comb2_s[0..1] = sheet U_Banks_13_14/m1_Comb2_s[0..1] = sheet U_Mezz1/m1_Comb2_s[0..1]
bus m1_Comb3_data[0..15] = sheet U_Banks_11_12/m1_Comb3_data[0..15] = sheet U_Mezz1/m1_Comb3_data[0..15]
bus m1_Comb3_s[0..1] = sheet U_Banks_11_12/m1_Comb3_s[0..1] = sheet U_Mezz1/m1_Comb3_s[0..1]
bus m1_Comb4_data[0..15] = sheet U_Banks_11_12/m1_Comb4_data[0..15] = sheet U_Mezz1/m1_Comb4_data[0..15]
bus m1_Comb4_s[0..1] = sheet U_Banks_11_12/m1_Comb4_s[0..1] = sheet U_Mezz1/m1_Comb4_s[0..1]
bus m1_DemodA_data[0..14] = sheet U_Banks_13_14/m1_DemodA_data[0..14] = sheet U_Mezz1/m1_DemodA_data[0..14]
bus m1_DemodA_s[0..1] = sheet U_Banks_13_14/m1_DemodA_s[0..1] = sheet U_Mezz1/m1_DemodA_s[0..1]
bus m1_DemodB_data[0..14] = sheet U_Banks_11_12/m1_DemodB_data[0..14] = sheet U_Mezz1/m1_DemodB_data[0..14]
bus m1_DemodB_s[0..1] = sheet U_Banks_11_12/m1_DemodB_s[0..1] = sheet U_Mezz1/m1_DemodB_s[0..1]
bus m1_power_data[0..7] = sheet U_Banks_3_4/m1_power_data[0..7] = sheet U_Mezz1/m1_power_data[0..7]
bus m2_aux[0..1] = sheet U_Banks_11_12/m2_aux[0..1] = sheet U_Mezz2/m2_aux[0..1]
bus m2_aux[2..4] = sheet U_Banks_13_14/m2_aux[2..4] = sheet U_Mezz2/m2_aux[2..4]
bus m2_clock[1..2] = sheet U_Banks_11_12/m2_clock[1..2] = sheet U_Mezz2/m2_clock[1..2]
bus m2_Comb1_data[0..15] = sheet U_Banks_13_14/m2_Comb1_data[0..15] = sheet U_Mezz2/m2_Comb1_data[0..15]
bus m2_Comb1_s[0..1] = sheet U_Banks_13_14/m2_Comb1_s[0..1] = sheet U_Mezz2/m2_Comb1_s[0..1]
bus m2_Comb2_data[0..15] = sheet U_Banks_13_14/m2_Comb2_data[0..15] = sheet U_Mezz2/m2_Comb2_data[0..15]
bus m2_Comb2_s[0..1] = sheet U_Banks_13_14/m2_Comb2_s[0..1] = sheet U_Mezz2/m2_Comb2_s[0..1]
bus m2_Comb3_data[0..15] = sheet U_Banks_11_12/m2_Comb3_data[0..15] = sheet U_Mezz2/m2_Comb3_data[0..15]
bus m2_Comb3_s[0..1] = sheet U_Banks_11_12/m2_Comb3_s[0..1] = sheet U_Mezz2/m2_Comb3_s[0..1]
bus m2_Comb4_data[0..15] = sheet U_Banks_11_12/m2_Comb4_data[0..15] = sheet U_Mezz2/m2_Comb4_data[0..15]
bus m2_Comb4_s[0..1] = sheet U_Banks_11_12/m2_Comb4_s[0..1] = sheet U_Mezz2/m2_Comb4_s[0..1]
bus m2_DemodA_data[0..14] = sheet U_Banks_13_14/m2_DemodA_data[0..14] = sheet U_Mezz2/m2_DemodA_data[0..14]
bus m2_DemodA_s[0..1] = sheet U_Banks_13_14/m2_DemodA_s[0..1] = sheet U_Mezz2/m2_DemodA_s[0..1]
bus m2_DemodB_data[0..14] = sheet U_Banks_11_12/m2_DemodB_data[0..14] = sheet U_Mezz2/m2_DemodB_data[0..14]
bus m2_DemodB_s[0..1] = sheet U_Banks_11_12/m2_DemodB_s[0..1] = sheet U_Mezz2/m2_DemodB_s[0..1]
bus m2_power_data[0..7] = sheet U_Banks_3_4/m2_power_data[0..7] = sheet U_Mezz2/m2_power_data[0..7]
bus POWER_DATA[0..6] = sheet U_Banks_1_2/POWER_DATA[0..6] = sheet U_Housekeeping/POWER_DATA[0..6]
bus SYSACE_MPA[0..6] = sheet U_Banks_7_8/SYSACE_MPA[0..6] = sheet U_SysACE_SysFLASH/SYSACE_MPA[0..6]
bus SYSACE_USB_D[0..15] = sheet U_Banks_7_8/SYSACE_USB_D[0..15] = sheet U_SysACE_SysFLASH/SYSACE_USB_D[0..15]
bus VME_A[1..7] = sheet U_Banks_9_10/VME_A[1..7] = sheet U_Eurocard VME 6U P1/VME_A[1..7]
bus VME_A[8..23] = sheet U_Banks_9_10/VME_A[8..23] = sheet U_Eurocard VME 6U P1/VME_A[8..23]
bus VME_AM[0..5] = sheet U_Banks_9_10/VME_AM[0..5] = sheet U_Eurocard VME 6U P1/VME_AM[0..5]
bus VME_BGIN[0..3] = sheet U_Banks_9_10/VME_BGIN[0..3] = sheet U_Eurocard VME 6U P1/VME_BGIN[0..3]
bus VME_BGOUT[0..3] = sheet U_Banks_9_10/VME_BGOUT[0..3] = sheet U_Eurocard VME 6U P1/VME_BGOUT[0..3]
bus VME_BR[0..3] = sheet U_Banks_9_10/VME_BR[0..3] = sheet U_Eurocard VME 6U P1/VME_BR[0..3]
bus VME_D[0..15] = sheet U_Banks_7_8/VME_D[0..15] = sheet U_Eurocard VME 6U P1/VME_D[0..15]
bus VME_IRQ[1..7] = sheet U_Banks_9_10/VME_IRQ[1..7] = sheet U_Eurocard VME 6U P1/VME_IRQ[1..7]
bus VME_UD[0..17] = sheet U_Banks_7_8/VME_UD[0..17] = sheet U_Eurocard VME 6U P2/VME_UD[0..17]

## Notes on the sheet
- Digital Readout Multiplexer Project, McGill University
- Matt Dobbs (Project Director) <Matt.Dobbs@McGill.ca>
  Nick Starinski (Layout/Altium Schematics, UdeM) <Nick.Starinski@gmail.com>
  George Zizka (Orcad Schematics, LBNL) <mazin@pacbell.net>
  Design and concepts Copyright 2006 M. Dobbs
- McGill Digital fMUX FPGA Motherboard
- Board Block Diagram
- 03
- N.Starinski, UdeM